# EAGLE design microMouse_schematic (EAGLE 9.5.2)
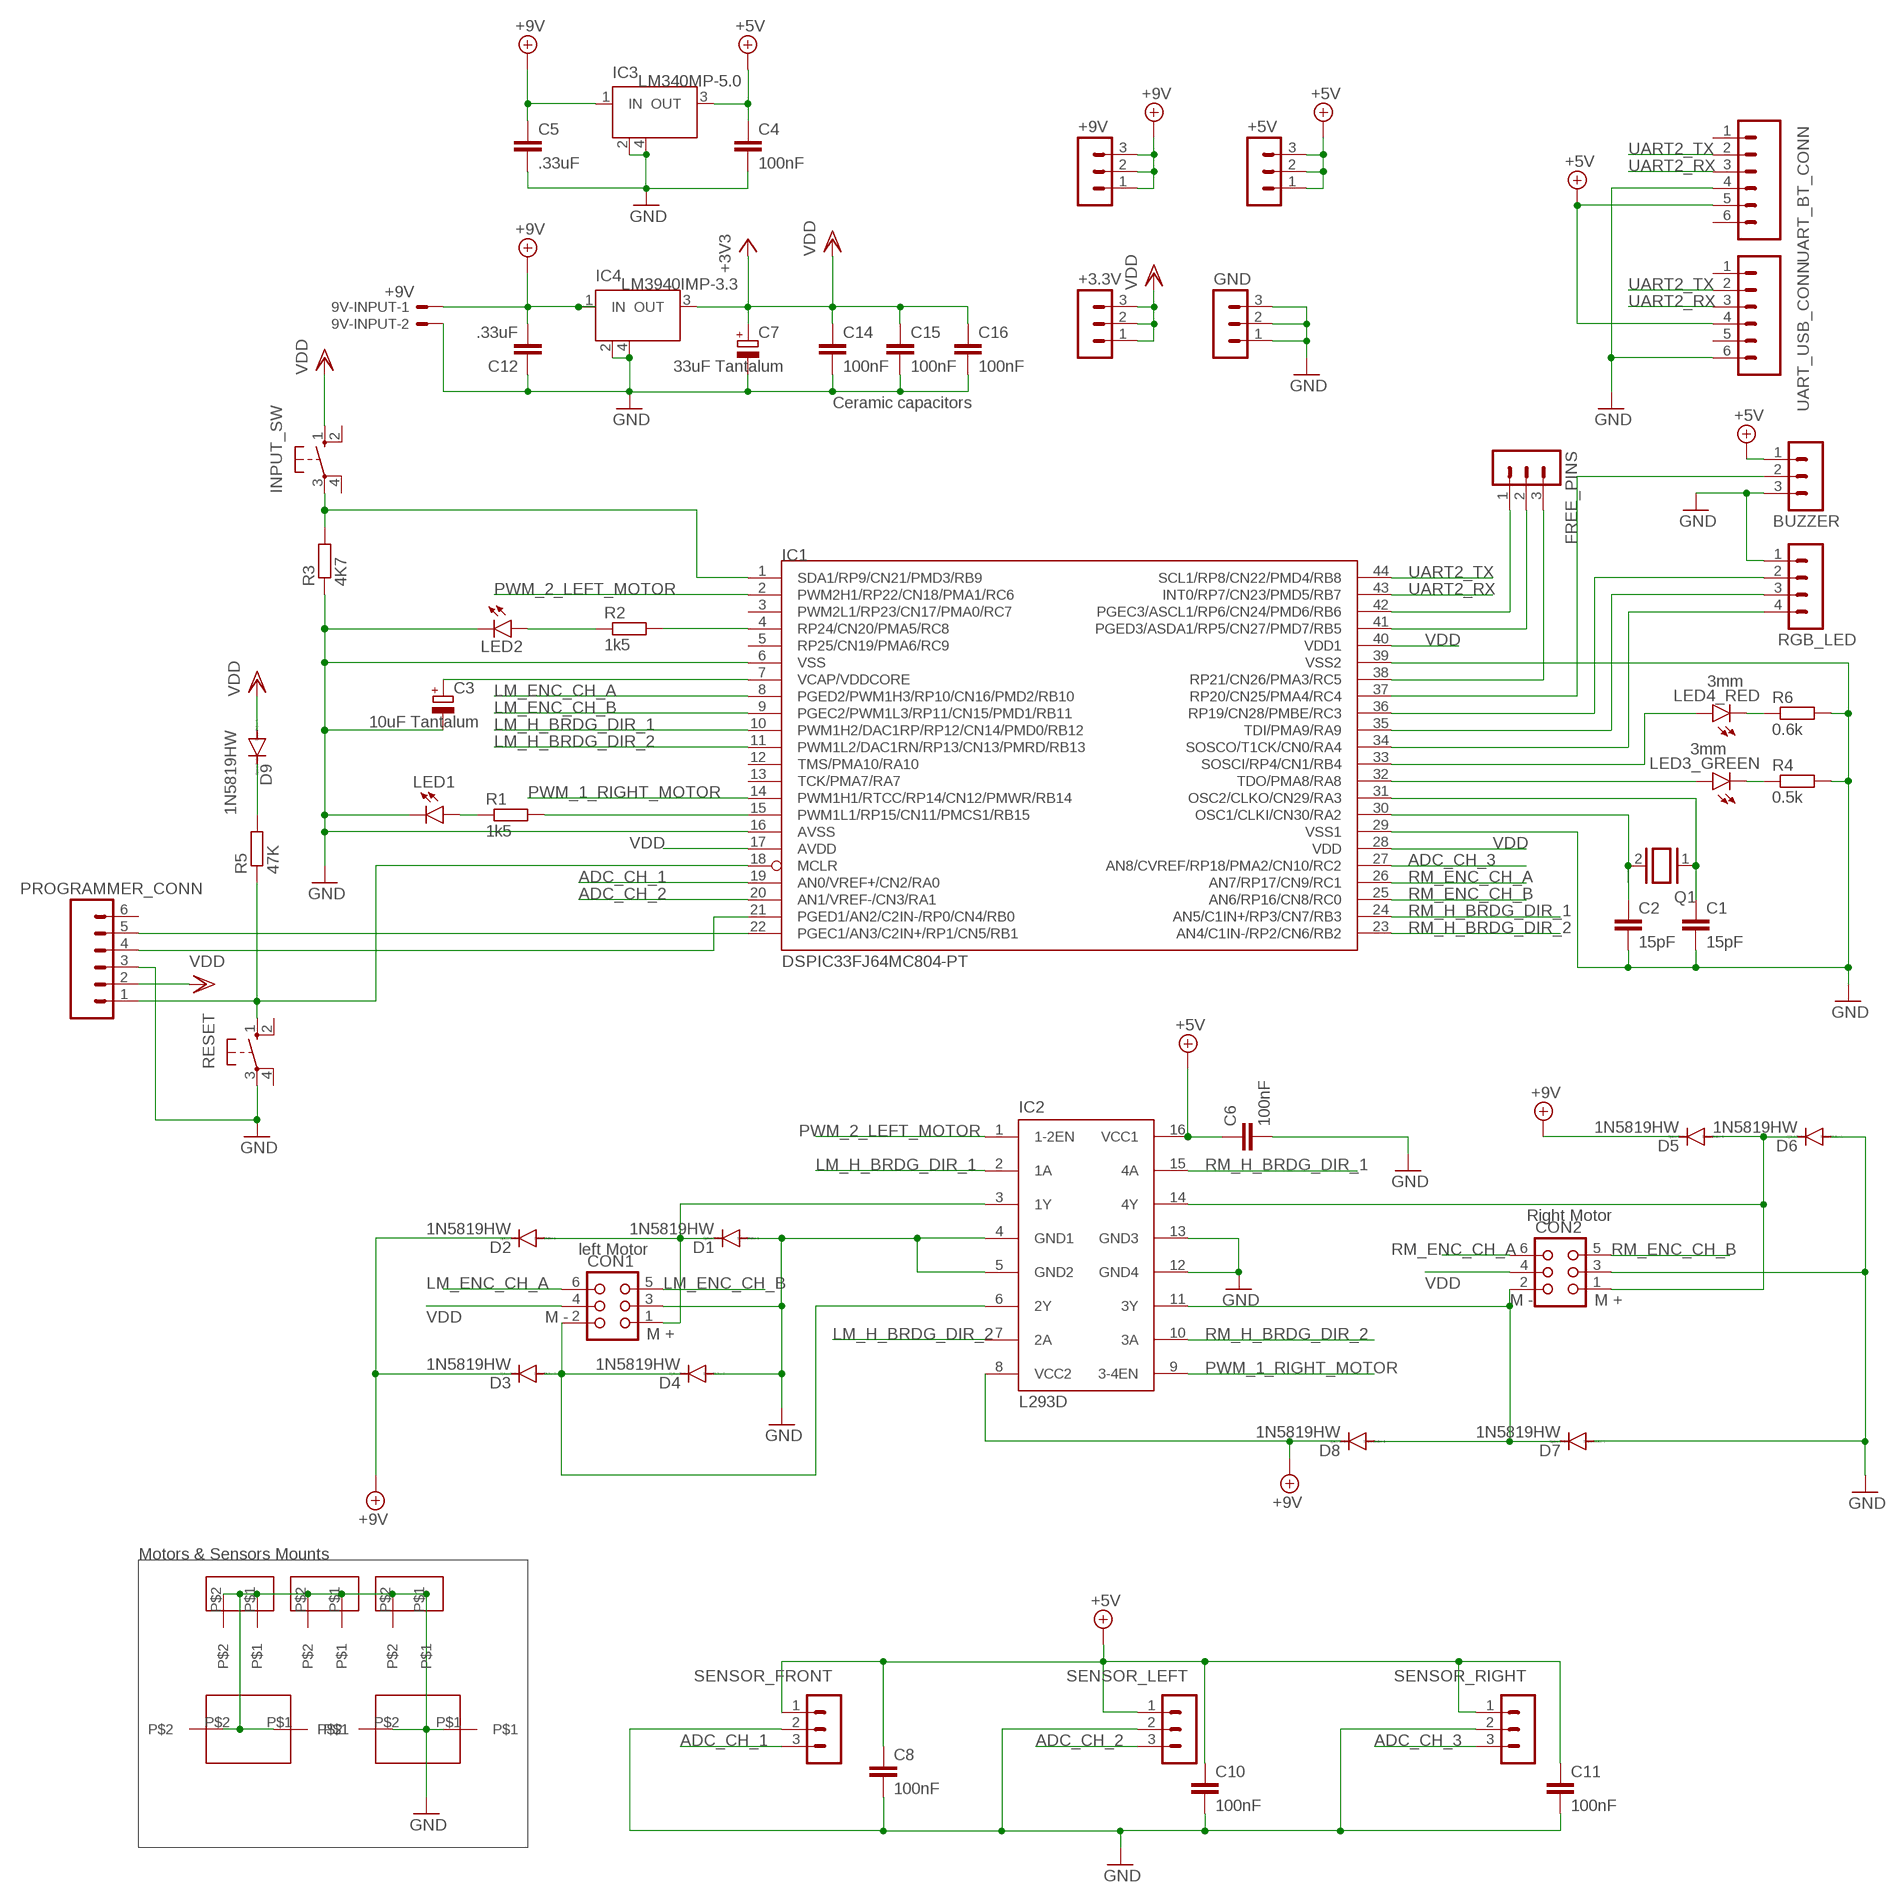
[diagram p0: schematic, sheet 1]

## Parts
9V-INPUT  +9V  22-23-2021  [22-23-2021]
+3.3V  MA03-1  [MA03-1]
+5V  MA03-1  [MA03-1]
+9V  MA03-1  [MA03-1]
BUZZER  MA03-1  [MA03-1]
C1  15pF  C-EUC0805  [C0805]
C2  15pF  C-EUC0805  [C0805]
C3  10uF Tantalum  CPOL-EUCT3216  [CT3216]
C4  100nF  C-EUC0805  [C0805]
C5  .33uF  C-EUC0805  [C0805]
C6  100nF  C-EUC0805  [C0805]
C7  33uF Tantalum  CPOL-EUCT7343  [CT7343]
C8  100nF  C-EUC0805  [C0805]
C10  100nF  C-EUC0805  [C0805]
C11  100nF  C-EUC0805  [C0805]
C12  .33uF  C-EUC0805  [C0805]
C14  100nF  C-EUC0805  [C0805]
C15  100nF  C-EUC0805  [C0805]
C16  100nF  C-EUC0805  [C0805]
CON1  CON06L  [CON06L]
CON2  CON06L  [CON06L]
D1  1N5819HW  CGRM4001-G  [SOD-123_MINI-SMA]
D2  1N5819HW  CGRM4001-G  [SOD-123_MINI-SMA]
D3  1N5819HW  CGRM4001-G  [SOD-123_MINI-SMA]
D4  1N5819HW  CGRM4001-G  [SOD-123_MINI-SMA]
D5  1N5819HW  CGRM4001-G  [SOD-123_MINI-SMA]
D6  1N5819HW  CGRM4001-G  [SOD-123_MINI-SMA]
D7  1N5819HW  CGRM4001-G  [SOD-123_MINI-SMA]
D8  1N5819HW  CGRM4001-G  [SOD-123_MINI-SMA]
D9  1N5819HW  CGRM4001-G  [SOD-123_MINI-SMA]
FREE_PINS  MA03-1  [MA03-1]
GND  MA03-1  [MA03-1]
IC1  DSPIC33FJ64MC804-PT  [TQFP44]
IC2  L293D  [DIL16]
IC3  LM340MP-5.0  LM340S  [SOT223]
IC4  LM3940IMP-3.3  LM340S  [SOT223]
INPUT_SW  10-XX  [B3F-10XX]
LED1  LED5MM  [LED5MM]
LED2  LED5MM  [LED5MM]
LED3_GREEN  3mm  LEDB155  [Q62902-B155]
LED4_RED  3mm  LEDB155  [Q62902-B155]
PROGRAMMER_CONN  M06  [06P]
Q1  XTAL/S  [QS]
R1  1k5  R-EU_R0805  [R0805]
R2  1k5  R-EU_R0805  [R0805]
R3  4K7  R-EU_R0805  [R0805]
R4  0.5k  R-EU_R0805  [R0805]
R5  47K  R-EU_R0805  [R0805]
R6  0.6k  R-EU_R0805  [R0805]
RESET  10-XX  [B3F-10XX]
RGB_LED  MA04-1  [MA04-1]
SENS_MNT_F  SENSOR_MOUNT_F  SENSOR_MOUNT  [SENSOR_MOUNT]
SENS_MNT_L  SENSOR_MOUNT_L  SENSOR_MOUNT  [SENSOR_MOUNT]
SENS_MNT_R  SENSOR_MOUNT_R  SENSOR_MOUNT  [SENSOR_MOUNT]
SENSOR_FRONT  MA03-1  [MA03-1]
SENSOR_LEFT  MA03-1  [MA03-1]
SENSOR_RIGHT  MA03-1  [MA03-1]
U$1  MOTOR_MOUNT  [MOTOR_MOUNT]
U$2  MOTOR_MOUNT  [MOTOR_MOUNT]
UART_BT_CONN  M06  [06P]
UART_USB_CONN  M06  [06P]

## Nets
+5V: +5V.1 +5V.2 +5V.3 BUZZER.1 C4.1 C6.1 C8.1 C10.1 C11.1 IC2.16(VCC1) IC3.3(OUT) SENSOR_FRONT.1 SENSOR_LEFT.1 SENSOR_RIGHT.1 UART_BT_CONN.5 UART_USB_CONN.4
+9V: 9V-INPUT.1 +9V.1 +9V.2 +9V.3 C5.1 C12.2 D2.C D3.C D5.C D8.C IC2.8(VCC2) IC3.1(IN) IC4.1(IN)
ADC_CH_1: IC1.19(AN0/VREF+/CN2/RA0) SENSOR_FRONT.3
ADC_CH_2: IC1.20(AN1/VREF-/CN3/RA1) SENSOR_LEFT.3
ADC_CH_3: IC1.27(AN8/CVREF/RP18/PMA2/CN10/RC2) SENSOR_RIGHT.3
GND: 9V-INPUT.2 BUZZER.3 C1.2 C2.2 C3.- C4.2 C5.2 C6.2 C7.- C8.2 C10.2 C11.2 C12.1 C14.2 C15.2 C16.2 CON1.3 CON2.3 D1.A D4.A D6.A D7.A GND.1 GND.2 GND.3 IC1.6(VSS) IC1.16(AVSS) IC1.29(VSS1) IC1.39(VSS2) IC2.4(GND1) IC2.5(GND2) IC2.12(GND4) IC2.13(GND3) IC3.2(GND) IC3.4(GND) IC4.2(GND) IC4.4(GND) LED1.K(C) LED2.K(C) PROGRAMMER_CONN.3 R3.1 R4.2 R6.2 RESET.3(P) RGB_LED.1 SENS_MNT_F.P$1 SENS_MNT_F.P$2 SENS_MNT_L.P$1 SENS_MNT_L.P$2 SENS_MNT_R.P$1 SENS_MNT_R.P$2 SENSOR_FRONT.2 SENSOR_LEFT.2 SENSOR_RIGHT.2 U$1.P$1 U$1.P$2 U$2.P$1 U$2.P$2 UART_BT_CONN.4 UART_USB_CONN.6
LM_ENC_CH_A: CON1.6 IC1.8(PGED2/PWM1H3/RP10/CN16/PMD2/RB10)
LM_ENC_CH_B: CON1.5 IC1.9(PGEC2/PWM1L3/RP11/CN15/PMD1/RB11)
LM_H_BRDG_DIR_1: IC1.10(PWM1H2/DAC1RP/RP12/CN14/PMD0/RB12) IC2.2(1A)
LM_H_BRDG_DIR_2: IC1.11(PWM1L2/DAC1RN/RP13/CN13/PMRD/RB13) IC2.7(2A)
N$1: IC1.4(RP24/CN20/PMA5/RC8) R2.2
N$2: CON2.1 D5.A D6.C IC2.14(4Y)
N$3: LED2.A R2.1
N$4: CON1.1 D1.C D2.A IC2.3(1Y)
N$5: IC1.22(PGEC1/AN3/C2IN+/RP1/CN5/RB1) PROGRAMMER_CONN.5
N$6: CON2.2 D7.C D8.A IC2.11(3Y)
N$7: CON1.2 D3.A D4.C IC2.6(2Y)
N$8: IC1.1(SDA1/RP9/CN21/PMD3/RB9) INPUT_SW.3(P) R3.2
N$9: IC1.32(TDO/PMA8/RA8) LED3_GREEN.A
N$10: C2.1 IC1.30(OSC1/CLKI/CN30/RA2) Q1.2
N$11: C1.1 IC1.31(OSC2/CLKO/CN29/RA3) Q1.1
N$12: IC1.21(PGED1/AN2/C2IN-/RP0/CN4/RB0) PROGRAMMER_CONN.4
N$13: LED3_GREEN.K(C) R4.1
N$14: IC1.15(PWM1L1/RP15/CN11/PMCS1/RB15) R1.2
N$15: IC1.33(SOSCI/RP4/CN1/RB4) LED4_RED.A
N$16: IC1.34(SOSCO/T1CK/CN0/RA4) RGB_LED.4
N$17: LED1.A R1.1
N$18: IC1.35(TDI/PMA9/RA9) RGB_LED.3
N$19: D9.C R5.2
N$20: IC1.36(RP19/CN28/PMBE/RC3) RGB_LED.2
N$21: BUZZER.2 IC1.37(RP20/CN25/PMA4/RC4)
N$22: FREE_PINS.1 IC1.42(PGEC3/ASCL1/RP6/CN24/PMD6/RB6)
N$23: FREE_PINS.2 IC1.41(PGED3/ASDA1/RP5/CN27/PMD7/RB5)
N$24: FREE_PINS.3 IC1.38(RP21/CN26/PMA3/RC5)
N$25: LED4_RED.K(C) R6.1
PWM_1_RIGHT_MOTOR: IC1.14(PWM1H1/RTCC/RP14/CN12/PMWR/RB14) IC2.9(3-4EN)
PWM_2_LEFT_MOTOR: IC1.2(PWM2H1/RP22/CN18/PMA1/RC6) IC2.1(1-2EN)
RESET: IC1.18(MCLR) PROGRAMMER_CONN.1 R5.1 RESET.1(S)
RM_ENC_CH_A: CON2.6 IC1.26(AN7/RP17/CN9/RC1)
RM_ENC_CH_B: CON2.5 IC1.25(AN6/RP16/CN8/RC0)
RM_H_BRDG_DIR_1: IC1.24(AN5/C1IN+/RP3/CN7/RB3) IC2.15(4A)
RM_H_BRDG_DIR_2: IC1.23(AN4/C1IN-/RP2/CN6/RB2) IC2.10(3A)
UART2_RX: IC1.43(INT0/RP7/CN23/PMD5/RB7) UART_BT_CONN.3 UART_USB_CONN.3
UART2_TX: IC1.44(SCL1/RP8/CN22/PMD4/RB8) UART_BT_CONN.2 UART_USB_CONN.2
VCAP/VDDCORE: C3.+ IC1.7(VCAP/VDDCORE)
VDD: +3.3V.1 +3.3V.2 +3.3V.3 C7.+ C14.1 C15.1 C16.1 CON1.4 CON2.4 D9.A IC1.17(AVDD) IC1.28(VDD) IC1.40(VDD1) IC4.3(OUT) INPUT_SW.1(S) PROGRAMMER_CONN.2 ; supply symbol labelled +3V3
Unconnected: IC1.3(PWM2L1/RP23/CN17/PMA0/RC7) IC1.5(RP25/CN19/PMA6/RC9) IC1.12(TMS/PMA10/RA10) IC1.13(TCK/PMA7/RA7) INPUT_SW.2(S1) INPUT_SW.4(P1) PROGRAMMER_CONN.6 RESET.2(S1) RESET.4(P1) UART_BT_CONN.1 UART_BT_CONN.6 UART_USB_CONN.1 UART_USB_CONN.5

## Notes on the sheet
- Ceramic capacitors
- Right Motor
- left Motor
- M - | M +
- M -
- M +
- Motors & Sensors Mounts

## Library data of the parts
9V-INPUT = con-molex:22-23-2021: .100" (2.54mm) Center Header - 2 Pin; MF: MOLEX; MPN: 22-23-2021; OC_FARNELL: 1462926; OC_NEWARK: 25C3832
+3.3V +5V +9V BUZZER FREE_PINS GND SENSOR_FRONT SENSOR_LEFT SENSOR_RIGHT = con-lstb:MA03-1: PIN HEADER; OC_FARNELL: unknown; OC_NEWARK: unknown
C1 C2 C4-C6 C8 C10-C12 C14-C16 = rcl:C-EU: CAPACITOR, European symbol; SPICEPREFIX: C
C3 C7 = rcl:CPOL-EU: POLARIZED CAPACITOR, European symbol; SPICEPREFIX: C
CON1 CON2 = con-harting:CON06L: CONNECTOR; OC_FARNELL: unknown; OC_NEWARK: unknown
D1-D9 = diode:CGRM400*-G: Molded plasitc,JEDEC SOD-123/Mini SMA Source: Comchip CGRM4001-G.pdf
IC1 = microchip-dspic33fjxxmc:DSPIC33FJ64MC804: dsPIC33FJ32MC302/304, dsPIC33FJ64MCX02/X04, AND dsPIC33FJ128MCX02/X04 High-Performance, 16-bit Digital Signal Controllers Package:44 Pin TQFP Operating Range: * Up to 40 MIPS operation (at 3.0V -3.6V): - Industrial temperature range (-40°C to +85°C) - Extended temperature range (-40°C to +125°C) High-Performance DSC CPU: * Modified Harvard architecture * C compiler optimized instruction set * 16-bit wide data path * 24-bit wide instructions * Linear program memory addressing up to 4M instruction words * Linear data memory addressing up to 64 Kbytes * 83 base instructions: mostly 1 word/1 cycle * Two 40-bit accumulators with rounding and saturation options * Flexible and powerful addressing modes: - Indirect - Modulo - Bit-Reversed * Software stack * 16 x 16 fractional/integer multiply operations * 32/16 and 16/16 divide operations * Single-cycle multiply and accumulate: - Accumulator write back for DSP operations - Dual data fetch * Up to ±16-bit shifts for up to 40-bit data Direct Memory Access (DMA): * 8-channel hardware DMA * Up to 2 Kbytes dual ported DMA buffer area (DMA RAM) to store data transferred via DMA: - Allows data transfer between RAM and a peripheral while CPU is executing code (no cycle stealing) * Most peripherals support DMA Timers/Capture/Compare/PWM: * Timer/Counters, up to five 16-bit timers: - Can pair up to make two 32-bit timers - One timer runs as a Real-Time Clock with an external 32.768 kHz oscillator - Programmable prescaler * Input Capture (up to four channels): - Capture on up, down or both edges - 16-bit capture input functions - 4-deep FIFO on each capture * Output Compare (up to four channels): - Single or Dual 16-bit Compare mode - 16-bit Glitchless PWM mode * Hardware Real-Time Clock/Calendar (RTCC): - Provides clock, calendar, and alarm functions Interrupt Controller: * 5-cycle latency * Up to 53 available interrupt sources * Up to three external interrupts * Seven programmable priority levels * Five processor exceptions Digital I/O: * Peripheral pin Select functionality * Up to 35 programmable digital I/O pins * Wake-up/Interrupt-on-Change for up to 31 pins * Output pins can drive from 3.0V to 3.6V * Up to 5V output with open drain configuration * All digital input pins are 5V tolerant * 4 mA sink on all I/O pins On-Chip Flash and SRAM: * Flash program memory (up to 128 Kbytes) * Data SRAM (up to 16 Kbytes) * Boot, Secure, and General Security for program Flash System Management: * Flexible clock options: - External, crystal, resonator, internal RC - Fully integrated Phase-Locked Loop (PLL) - Extremely low jitter PLL * Power-up Timer * Oscillator Start-up Timer/Stabilizer * Watchdog Timer with its own RC oscillator * Fail-Safe Clock Monitor * Reset by multiple sources Power Management: * On-chip 2.5V voltage regulator * Switch between clock sources in real time * Idle, Sleep, and Doze modes with fast wake-up Analog-to-Digital Converters (ADCs): * 10-bit, 1.1 Msps or 12-bit, 500 Ksps conversion: - Two and four simultaneous samples (10-bit ADC) - Up to nine input channels with auto-scanning - Conversion start can be manual or synchronized with one of four trigger sources - Conversion possible in Sleep mode - ±2 LSb max integral nonlinearity - ±1 LSb max differential nonlinearity Audio Digital-to-Analog Converter (DAC): - 16-bit Dual Channel DAC module - 100 Ksps maximum sampling rate - Second-Order Digital Delta-Sigma Modulator Comparator Module: * Two analog comparators with programmable input/output configuration CMOS Flash Technology: * Low-power, high-speed Flash technology * Fully static design * 3.3V (±10%) operating voltage * Industrial and Extended temperature * Low power consumption Motor Control Peripherals: * 6-channel 16-bit Motor Control PWM: - Three duty cycle generators - Independent or Complementary mode - Programmable dead-time and output polarity - Edge-aligned or center-aligned - Manual output override control - One Fault input - Trigger for ADC conversions - PWM frequency for 16-bit resolution (@ 40 MIPS) = 1220 Hz for Edge-Aligned mode, 610 Hz for Center-Aligned mode - PWM frequency for 11-bit resolution (@ 40 MIPS) = 39.1 kHz for Edge-Aligned mode, 19.55 kHz for Center-Aligned mode * 2-channel 16-bit Motor Control PWM: - One duty cycle generator - Independent or Complementary mode - Programmable dead time and output polarity - Edge-aligned or center-aligned - Manual output override control - One Fault input - Trigger for ADC conversions - PWM frequency for 16-bit resolution (@ 40 MIPS) = 1220 Hz for Edge-Aligned mode, 610 Hz for Center-Aligned mode - PWM frequency for 11-bit resolution (@ 40 MIPS) = 39.1 kHz for Edge-Aligned mode, 19.55 kHz for Center-Aligned mode * 2-Quadrature Encoder Interface module: - Phase A, Phase B, and index pulse input - 16-bit up/down position counter - Count direction status - Position Measurement (x2 and x4) mode - Programmable digital noise filters on inputs - Alternate 16-bit Timer/Counter mode - Interrupt on position counter rollover/underflow
IC2 = st-microelectronics:L293D: PUSH-PULL 4 CHANNEL DRIVER; MPN: L293D; OC_FARNELL: 9589619; OC_NEWARK: 56P8249
IC3 IC4 = linear:LM340S: 3-Terminal Positive Regulators Source: http://cache.national.com/ds/LM/LM340.pdf
INPUT_SW RESET = switch-omron:10-XX: OMRON SWITCH; MPN: B3F-1000; OC_FARNELL: 176432; OC_NEWARK: 36M3542
LED1 LED2 LED3_GREEN LED4_RED = led:LED: LED OSRAM: - CHIPLED LG R971, LG N971, LY N971, LG Q971, LY Q971, LO R971, LY R971 LH N974, LH R974 LS Q976, LO Q976, LY Q976 LO Q996 - Hyper CHIPLED LW Q18S LB Q993, LB Q99A, LB R99A - SideLED LS A670, LO A670, LY A670, LG A670, LP A670 LB A673, LV A673, LT A673, LW A673 LH A674 LY A675 LS A676, LA A676, LO A676, LY A676, LW A676 LS A679, LY A679, LG A679 - Hyper Micro SIDELED® LS Y876, LA Y876, LO Y876, LY Y876 LT Y87S - SmartLED LW L88C, LW L88S LB L89C, LB L89S, LG L890 LS L89K, LO L89K, LY L89K LS L896, LA L896, LO L896, LY L896 - TOPLED LS T670, LO T670, LY T670, LG T670, LP T670 LSG T670, LSP T670, LSY T670, LOP T670, LYG T670 LG T671, LOG T671, LSG T671 LB T673, LV T673, LT T673, LW T673 LH T674 LS T676, LA T676, LO T676, LY T676, LB T676, LH T676, LSB T676, LW T676 LB T67C, LV T67C, LT T67C, LS T67K, LO T67K, LY T67K, LW E67C LS E67B, LA E67B, LO E67B, LY E67B, LB E67C, LV E67C, LT E67C LW T67C LS T679, LY T679, LG T679 LS T770, LO T770, LY T770, LG T770, LP T770 LB T773, LV T773, LT T773, LW T773 LH T774 LS E675, LA E675, LY E675, LS T675 LS T776, LA T776, LO T776, LY T776, LB T776 LHGB T686 LT T68C, LB T68C - Hyper Mini TOPLED® LB M676 - Mini TOPLED Santana® LG M470 LS M47K, LO M47K, LY M47K Source: http://www.osram.convergy.de LUXEON: - LUMILED® LXK2-PW12-R00, LXK2-PW12-S00, LXK2-PW14-U00, LXK2-PW14-V00 LXK2-PM12-R00, LXK2-PM12-S00, LXK2-PM14-U00 LXK2-PE12-Q00, LXK2-PE12-R00, LXK2-PE12-S00, LXK2-PE14-T00, LXK2-PE14-U00 LXK2-PB12-K00, LXK2-PB12-L00, LXK2-PB12-M00, LXK2-PB14-N00, LXK2-PB14-P00, LXK2-PB14-Q00 LXK2-PR12-L00, LXK2-PR12-M00, LXK2-PR14-Q00, LXK2-PR14-R00 LXK2-PD12-Q00, LXK2-PD12-R00, LXK2-PD12-S00 LXK2-PH12-R00, LXK2-PH12-S00 LXK2-PL12-P00, LXK2-PL12-Q00, LXK2-PL12-R00 Source: www.luxeon.com KINGBRIGHT: KA-3528ASYC Source: www.kingbright.com
PROGRAMMER_CONN UART_BT_CONN UART_USB_CONN = con-amp-quick:M06: AMP QUICK CONNECTOR; OC_FARNELL: unknown; OC_NEWARK: unknown
Q1 = special:XTAL/S: CRYSTAL
R1-R6 = rcl:R-EU_: RESISTOR, European symbol; SPICEPREFIX: R
RGB_LED = con-lstb:MA04-1: PIN HEADER; OC_FARNELL: unknown; OC_NEWARK: unknown
SENS_MNT_F SENS_MNT_L SENS_MNT_R = linear:SENSOR_MOUNT
U$1 U$2 = linear:MOTOR_MOUNT

## Board
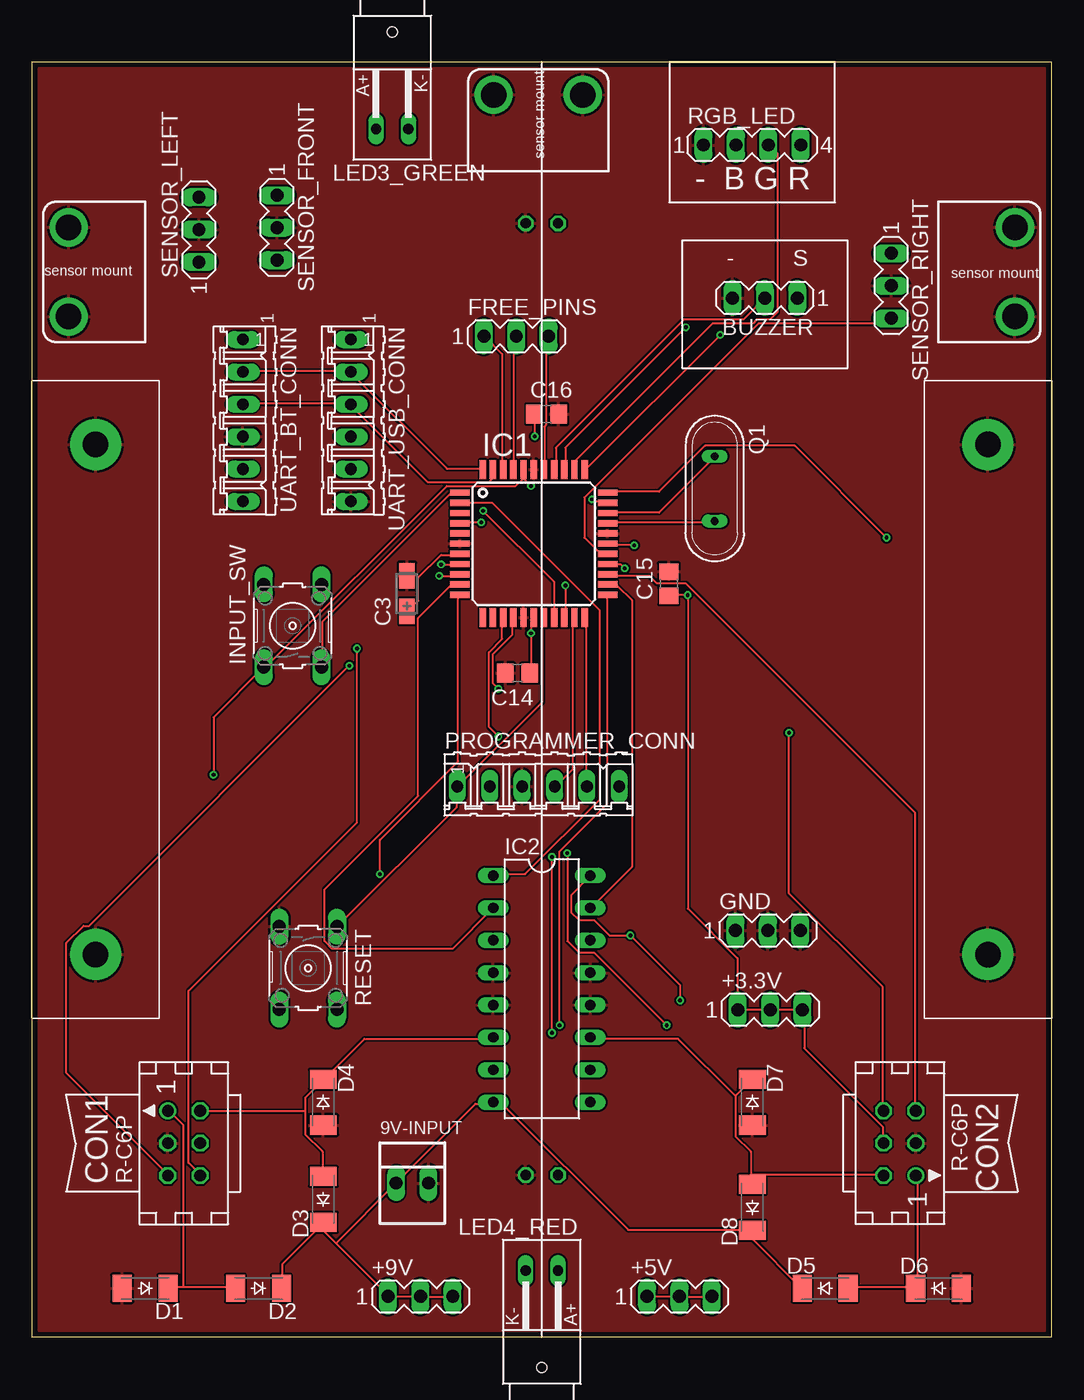
[diagram p1: board, top side]
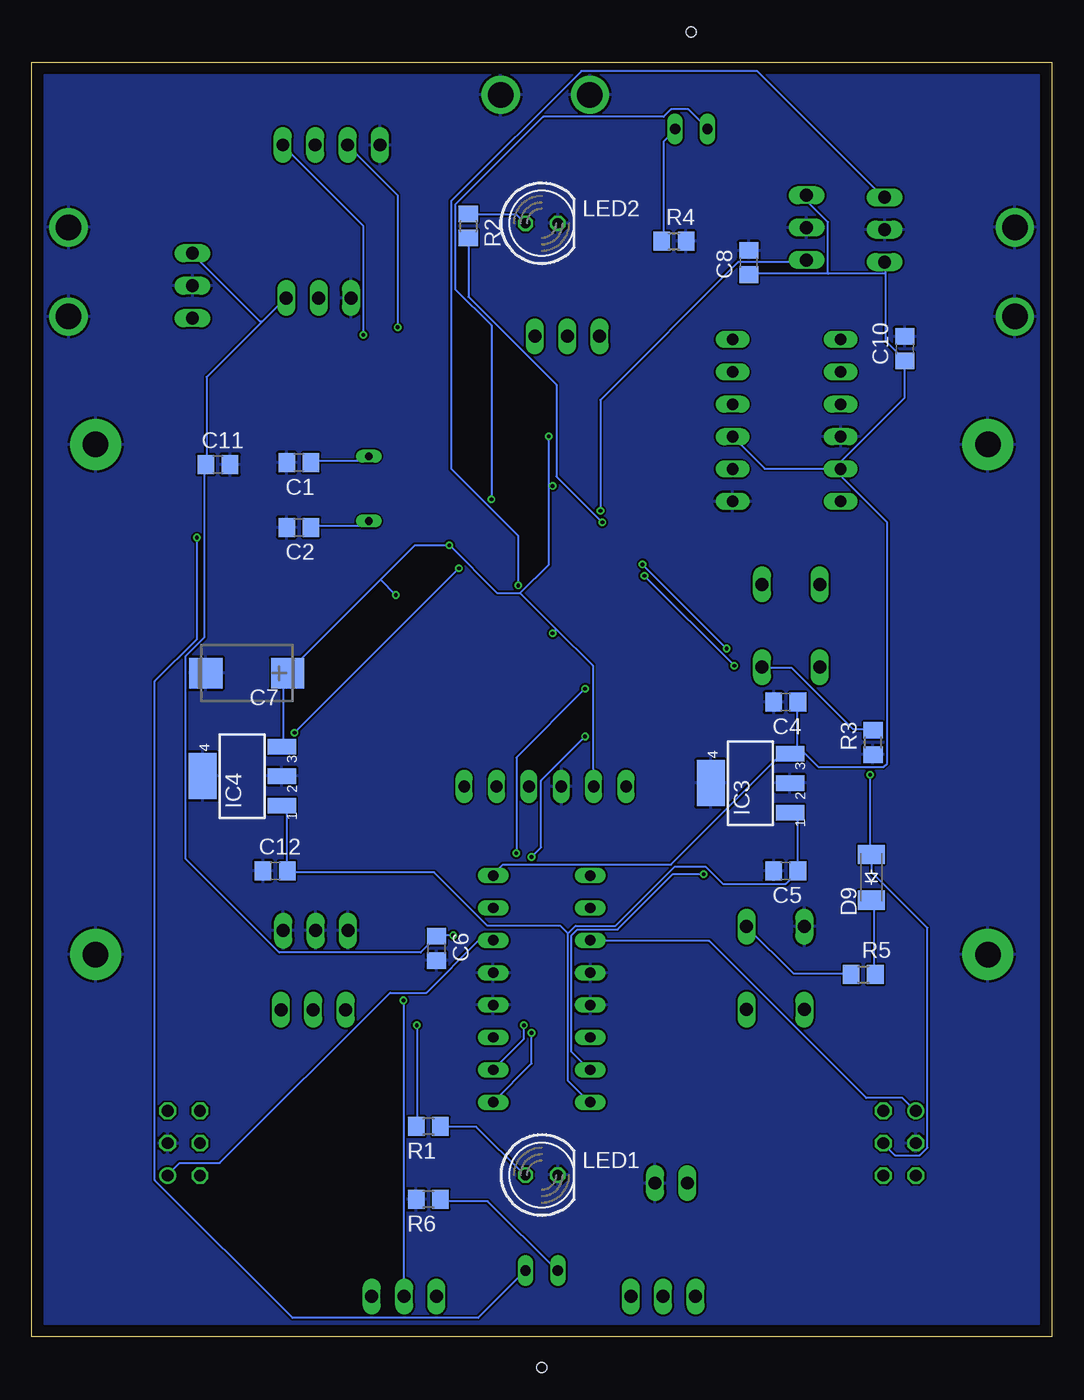
[diagram p2: board, bottom side, seen from below]

Size 80 x 100 mm. Coordinates in mm from the lower left corner, seen from the top.
Outline: 0,0 80,0 80,100 0,100 0,0
Copper layers (1*16): Top 0.035mm / dielectric 1.5mm / Bottom 0.035mm
Design rules "PCB-POOL Standard": minimum track width 0.15mm, minimum drill 0.3mm, track to track 0.15mm, track to pad 0.15mm, pad to pad 0.15mm, via to via 0.15mm, smd to smd 0.15mm, copper to edge 0.3mm, drill to drill 0.2mm, minimum pad ring 0.2mm, minimum via ring 0.15mm, stop-mask expansion 0.03mm, vias tented up to drill 0mil, thermal gap 0.2mm

### Footprints (pad centres in the part's own frame; a part is rotated, then mirrored left to right if it is on the bottom)
22-23-2021 = drill 1 long: 1 -1.27,0; 2 1.27,0
MA03-1 = drill 1.016 long: 1 -2.54,0; 2 0,0; 3 2.54,0
C0805 = smd 1.3 x 1.5: 1 -0.95,0; 2 0.95,0
CT3216 = smd 2 x 1.2: + -1.4,0; - 1.4,0
CT7343 = smd 2.6 x 2.4: + -3.2,0; - 3.2,0
CON06L = drill 0.914: 1 2.54,1.27 | drill 0.914 octagon: 2 2.54,-1.27; 3 0,1.27; 4 0,-1.27; 5 -2.54,1.27; 6 -2.54,-1.27
SOD-123_MINI-SMA = smd 1.5 x 2.1: A 1.8,0; C -1.8,0
TQFP44 = smd 1.5 x 0.5: 1 -5.8,4; 2 -5.8,3.2; 3 -5.8,2.4; 4 -5.8,1.6; 5 -5.8,0.8; 6 -5.8,0; 7 -5.8,-0.8; 8 -5.8,-1.6; 9 -5.8,-2.4; 10 -5.8,-3.2; 11 -5.8,-4; 23 5.8,-4; 24 5.8,-3.2; 25 5.8,-2.4; 26 5.8,-1.6; 27 5.8,-0.8; 28 5.8,0; 29 5.8,0.8; 30 5.8,1.6; 31 5.8,2.4; 32 5.8,3.2; 33 5.8,4 | smd 0.5 x 1.5: 12 -4,-5.8; 13 -3.2,-5.8; 14 -2.4,-5.8; 15 -1.6,-5.8; 16 -0.8,-5.8; 17 0,-5.8; 18 0.8,-5.8; 19 1.6,-5.8; 20 2.4,-5.8; 21 3.2,-5.8; 22 4,-5.8; 34 4,5.8; 35 3.2,5.8; 36 2.4,5.8; 37 1.6,5.8; 38 0.8,5.8; 39 0,5.8; 40 -0.8,5.8; 41 -1.6,5.8; 42 -2.4,5.8; 43 -3.2,5.8; 44 -4,5.8
DIL16 = drill 0.813 long: 1 -8.89,-3.81; 2 -6.35,-3.81; 3 -3.81,-3.81; 4 -1.27,-3.81; 5 1.27,-3.81; 6 3.81,-3.81; 7 6.35,-3.81; 8 8.89,-3.81; 9 8.89,3.81; 10 6.35,3.81; 11 3.81,3.81; 12 1.27,3.81; 13 -1.27,3.81; 14 -3.81,3.81; 15 -6.35,3.81; 16 -8.89,3.81
SOT223 = smd 1.219 x 2.235: 1 -2.311,-3.099; 2 0,-3.099; 3 2.311,-3.099 | smd 3.6 x 2.2: 4 0,3.099
B3F-10XX = drill 1.016 long: 1 -3.251,2.261; 2 3.251,2.261; 3 -3.251,-2.261; 4 3.251,-2.261
LED5MM = drill 0.813 octagon: A -1.27,0; K 1.27,0
Q62902-B155 = drill 0.813 long: A 7.62,-1.27; K 7.62,1.27 | hole 0.813: 0,0
06P = drill 0.914 long: 1 -6.35,0; 2 -3.81,0; 3 -1.27,0; 4 1.27,0; 5 3.81,0; 6 6.35,0
QS = drill 0.61 long: 1 -2.54,0; 2 2.54,0
R0805 = smd 1.3 x 1.5: 1 -0.95,0; 2 0.95,0
MA04-1 = drill 1.016 long: 1 -3.81,0; 2 -1.27,0; 3 1.27,0; 4 3.81,0
SENSOR_MOUNT = drill 2 pad 3: P$1 6,2; P$2 6,9
MOTOR_MOUNT = drill 2 pad 4: P$1 5,5; P$2 45,5

### Placement (x,y rotation side)
9V-INPUT  29.84,12.06 0 top
+3.3V  57.92,25.67 0 top
+5V  50.8,3.17 0 top
+9V  30.48,3.17 0 top
BUZZER  57.5,81.5 180 top
C1  59.05,68.58 180 bottom
C2  59.05,63.5 180 bottom
C3  29.43,58.31 90 top
C4  20.86,49.8 180 bottom
C5  20.86,36.56 180 bottom
C6  48.26,30.48 270 bottom
C7  63.15,52.07 180 bottom
C8  23.77,84.28 90 bottom
C10  11.53,77.53 90 bottom
C11  65.41,68.43 0 bottom
C12  60.92,36.56 0 bottom
C14  38.1,52.07 180 top
C15  49.97,59.08 90 top
C16  40.37,72.39 0 top
CON1  11.93,15.2 90 top
CON2  68.08,15.2 270 top
D1  8.89,3.81 180 top
D2  17.78,3.81 180 top
D3  22.86,10.79 90 top
D4  22.86,18.41 270 top
D5  62.23,3.81 0 top
D6  71.12,3.81 0 top
D7  56.52,18.41 270 top
D8  56.52,10.16 90 top
D9  14.14,36.06 90 bottom
FREE_PINS  38,78.5 0 top
GND  57.74,31.89 0 top
IC1  39.37,62.23 0 top
IC2  40.01,27.3 270 top
IC3  23.63,43.45 90 bottom
IC4  63.5,44 90 bottom
INPUT_SW  20.45,55.78 90 top
LED1  40.01,12.7 0 bottom
LED2  40.01,87.36 0 bottom
LED3_GREEN  28.27,102.37 270 top
LED4_RED  40.01,-2.4 90 top
PROGRAMMER_CONN  39.73,43.18 0 top
Q1  53.57,66.54 270 top
R1  48.9,16.51 180 bottom
R2  45.77,87.14 270 bottom
R3  14.01,46.62 90 bottom
R4  29.63,85.94 0 bottom
R5  14.78,28.44 0 bottom
R6  48.9,10.79 180 bottom
RESET  21.67,28.94 270 top
RGB_LED  56.5,93.5 0 top
SENS_MNT_F  71.12,78.04 0 top
SENS_MNT_L  45.22,91.44 90 top
SENS_MNT_R  8.89,89.04 180 top
SENSOR_FRONT  19.23,87.02 270 top
SENSOR_LEFT  13.11,86.86 90 top
SENSOR_RIGHT  67.41,82.45 270 top
U$1  10,25 90 top
U$2  80,25 90 top
UART_BT_CONN  16.55,71.89 270 top
UART_USB_CONN  25.04,71.89 270 top

### Tracks (layer width: path | path; a pad name or v marks a point on that pad's centre or on a via)
+5V  (via drill 0.3)
  Top 0.15: +5V.1 48.3,3.15 50.7,3.15 +5V.2 50.85,3.15 53.25,3.15 +5V.3 | IC2.16 43.8,36.15 42.3,34.65 42.3,33.3 42.9,32.7 44.1,32.7 45.3,31.5 v46.95,31.5 50.85,27.6 v50.85,26.4
  Bottom 0.15: UART_BT_CONN.5 16.65,68.1 22.5,68.1 24.9,70.5 UART_USB_CONN.4 | 13.05,83.4 13.05,84.3 SENSOR_LEFT.1 | 13.05,83.4 13.05,78.15 11.55,76.65 C10.1 11.55,76.5 11.55,73.65 16.5,68.7 16.5,68.1 UART_BT_CONN.5 | 13.05,83.4 17.55,83.4 | 17.55,83.4 23.7,83.4 C8.1 | 17.55,83.4 17.55,87.45 19.2,89.1 19.2,89.55 SENSOR_FRONT.1 | 61.95,79.65 60.15,81.45 BUZZER.1 | 61.95,79.65 66.3,75.3 66.3,68.55 C11.1 66.45,68.4 66.45,54.9 67.95,53.4 67.95,37.5 60.6,30.15 49.5,30.15 48.3,31.35 C6.1 48.15,31.5 v46.95,31.5 | 61.95,79.65 62.1,79.65 67.35,84.9 SENSOR_RIGHT.1 | 19.95,46.35 19.95,49.8 C4.1 | 19.95,46.35 20.4,45.9 IC3.3 | IC3.3 20.55,45.75 21.15,45.75 29.85,37.05 43.05,37.05 43.8,36.3 IC2.16 | v50.85,26.4 50.85,3.3 +5V.2 | 19.95,46.35 18.3,44.7 13.2,44.7 12.9,45 12.9,63.9 16.5,67.5 16.5,67.95 UART_BT_CONN.5 | 19.95,46.35 IC3.3
+9V
  Top 0.15: +9V.3 33,3.15 30.6,3.15 +9V.2 30.45,3.15 28.05,3.15 +9V.1 27.9,3.3 23.85,7.35 | 22.5,8.55 22.8,8.85 D3.C 22.5,8.55 | 22.5,8.55 19.65,5.7 19.65,3.9 D2.C | 23.85,7.35 22.65,8.55 22.5,8.55 | D5.C 60.3,3.9 56.55,7.65 56.55,8.25 D8.C 56.4,8.4 46.8,8.4 36.9,18.3 36.3,18.3 IC2.8 36.15,18.3 34.8,18.3 28.65,12.15 9V-INPUT.1 28.5,12 23.85,7.35
  Bottom 0.15: IC4.1 60.3,41.55 60,41.25 60,36.6 C12.2 59.85,36.45 48.45,36.45 44.25,32.25 38.55,32.25 37.95,31.65 | IC3.1 20.4,41.1 19.95,40.65 19.95,36.6 C5.1 19.95,36.45 20.85,35.55 25.8,35.55 27.15,36.9 29.55,36.9 34.2,32.25 37.35,32.25 37.95,31.65 | 37.95,31.65 37.95,20.1 36.3,18.45 IC2.8
ADC_CH_1  (via drill 0.3)
  Top 0.15: v35.4,64.8 40.95,59.25 40.95,56.55 IC1.19
  Bottom 0.15: v35.4,64.8 35.4,73.5 24.6,84.3 19.5,84.3 19.35,84.45 SENSOR_FRONT.3
ADC_CH_2  (via drill 0.3)
  Top 0.15: v41.85,58.95 41.85,56.55 IC1.20
  Bottom 0.15: v41.85,58.95 41.85,62.85 47.1,68.1 47.1,89.1 36.9,99.3 23.1,99.3 13.2,89.4 SENSOR_LEFT.3
ADC_CH_3
  Top 0.15: IC1.27 45.15,61.5 44.55,61.5 43.35,62.7 43.35,65.85 57,79.5 67.05,79.5 67.35,79.8 SENSOR_RIGHT.3
GND
  pour Bottom: 1,1 79,1 79,99 1,99
  pour Top: 0.5,0.5 79.5,0.5 79.5,99.5 0.5,99.5
LM_ENC_CH_A  (via drill 0.3)
  Top 0.15: v32.1,60.6 33.45,60.6 IC1.8 | v25.5,54 25.5,40.35 12.3,27.15 12.3,13.65 13.2,12.75 CON1.6
  Bottom 0.15: v25.5,54 v32.1,60.6
LM_ENC_CH_B  (via drill 0.3)
  Top 0.15: v31.95,59.7 33.45,59.7 IC1.9 | v24.9,52.65 4.5,32.25 4.05,32.25 2.7,30.9 2.7,20.7 10.65,12.75 CON1.5
  Bottom 0.15: v24.9,52.65 v31.95,59.7
LM_H_BRDG_DIR_1
  Top 0.15: IC1.10 33.45,58.95 32.85,58.95 30.3,56.4 30.3,42.45 22.95,35.1 22.95,31.05 23.55,30.45 33,30.45 36.15,33.6 IC2.2
LM_H_BRDG_DIR_2  (via drill 0.3)
  Top 0.15: v27.3,36.3 27.3,39 33.45,45.15 33.45,58.2 IC1.11
  Bottom 0.15: v27.3,36.3 29.7,36.3 34.05,31.95 37.2,31.95 37.65,31.5 37.65,22.35 36.3,21 IC2.7
N$1  (via drill 0.3)
  Top 0.15: v35.25,63.9 33.6,63.9 IC1.4
  Bottom 0.15: v35.25,63.9 38.85,67.5 38.85,74.7 45.75,81.6 45.75,86.1 R2.2
N$2
  Top 0.15: D5.A 64.05,3.9 69.3,3.9 D6.C 69.45,3.9 69.45,12.6 CON2.1
  Bottom 0.15: IC2.14 43.95,31.05 45,31.05 49.05,27 51.9,27 65.25,13.65 68.4,13.65 69.3,12.75 CON2.1
N$3
  Bottom 0.15: R2.1 45.75,88.05 42,88.05 41.4,87.45 LED2.A
N$4
  Top 0.15: 11.85,3.9 15.9,3.9 D2.A | 11.85,3.9 10.8,3.9 D1.C | 11.85,3.9 11.85,16.65 10.8,17.7 CON1.1
  Bottom 0.15: IC2.3 36.15,31.05 26.85,31.05 14.55,18.75 11.7,18.75 10.8,17.85 CON1.1
N$5
  Top 0.15: IC1.22 43.5,56.4 43.5,43.2 PROGRAMMER_CONN.5
N$6
  Top 0.15: 56.4,12.75 56.4,14.55 55.2,15.75 55.2,18.9 | 56.4,12.75 56.4,12 D8.A | D7.C 55.2,18.9 | 55.2,18.9 50.7,23.4 43.95,23.4 IC2.11 | 56.4,12.75 66.75,12.75 CON2.2
N$7
  Top 0.15: 21.45,17.7 21.45,18.75 22.8,20.1 D4.C 22.95,20.25 26.1,23.4 36.15,23.4 IC2.6 | 21.45,17.7 21.45,15.9 22.8,14.55 22.8,12.6 D3.A | 21.45,17.7 13.2,17.7 CON1.2
N$8
  Top 0.15: IC1.1 33.45,66.15 32.85,66.15 22.8,56.1 22.8,52.65 INPUT_SW.3
  Bottom 0.15: R3.2 14.1,47.7 15.6,47.7 20.4,52.5 22.65,52.5 INPUT_SW.3
N$9  (via drill 0.3)
  Top 0.15: v43.95,65.7 44.1,65.55 45.15,65.55 IC1.32
  Bottom 0.15: v43.95,65.7 43.95,79.35 46.8,82.2 46.8,88.8 39.9,95.7 30.45,95.7 29.85,96.3 28.5,96.3 27,94.8 LED3_GREEN.A
N$10
  Top 0.15: IC1.30 45.3,63.9 53.55,63.9 Q1.2
  Bottom 0.15: C2.1 58.05,63.6 54,63.6 53.7,63.9 Q1.2
N$11
  Top 0.15: IC1.31 45.3,64.65 49.2,64.65 53.55,69 Q1.1
  Bottom 0.15: C1.1 58.05,68.7 54,68.7 53.7,69 Q1.1
N$12
  Top 0.15: IC1.21 42.45,56.4 42.45,44.55 41.1,43.2 PROGRAMMER_CONN.4
N$13
  Bottom 0.15: R4.1 30.45,85.95 30.45,93.75 29.55,94.65 LED3_GREEN.K
N$14  (via drill 0.3)
  Top 0.15: v49.8,24.45 44.1,30.15 42.9,30.15 42,31.05 v42,37.95 | v36.6,50.85 36.15,51.3 36.15,53.55 37.65,55.05 37.65,56.4 IC1.15
  Bottom 0.15: v49.8,24.45 49.8,16.65 R1.2 | v42,37.95 42,45.45 v36.6,50.85
N$15  (via drill 0.3)
  Top 0.15: v67.05,62.7 59.85,69.9 52.8,69.9 49.2,66.3 45.3,66.3 IC1.33
  Bottom 0.15: v67.05,62.7 67.05,54.75 70.35,51.45 70.35,12.3 59.55,1.5 45,1.5 41.4,5.1 LED4_RED.A
N$16  (via drill 0.3)
  Top 0.15: v54,78.6 43.5,68.1 IC1.34
  Bottom 0.15: v54,78.6 54,87.15 60.3,93.45 RGB_LED.4
N$17
  Bottom 0.15: R1.1 47.85,16.5 45.15,16.5 41.4,12.75 LED1.A
N$18
  Top 0.15: IC1.35 42.6,68.1 42.6,68.7 53.4,79.5 56.55,79.5 56.85,79.8 57.9,79.8 58.5,80.4 58.5,92.85 57.9,93.45 RGB_LED.3
N$19
  Bottom 0.15: R5.2 13.95,28.5 13.95,34.05 14.1,34.2 D9.C
N$20  (via drill 0.3)
  Top 0.15: v51.3,79.2 41.85,69.75 41.85,68.1 IC1.36
  Bottom 0.15: v51.3,79.2 51.3,89.55 55.2,93.45 RGB_LED.2
N$21
  Top 0.15: BUZZER.2 55.8,79.8 51.15,79.8 41.1,69.75 41.1,68.1 IC1.37
N$22
  Top 0.15: IC1.42 36.9,68.1 36.9,77.1 35.55,78.45 FREE_PINS.1
N$23
  Top 0.15: FREE_PINS.2 37.8,78.3 37.8,68.1 IC1.41
N$24
  Top 0.15: IC1.38 40.2,68.1 40.2,71.4 40.35,71.55 40.35,78.3 40.5,78.45 FREE_PINS.3
N$25
  Bottom 0.15: R6.1 47.85,10.65 44.25,10.65 38.85,5.25 LED4_RED.K
PWM_1_RIGHT_MOTOR  (via drill 0.3)
  Top 0.15: v36.6,47.1 35.85,47.85 35.85,53.7 36.9,54.75 36.9,56.4 IC1.14 | v40.8,23.85 v40.8,37.65
  Bottom 0.15: v36.6,47.1 40.05,43.65 40.05,38.4 v40.8,37.65 | v40.8,23.85 40.8,21.45 43.8,18.45 IC2.9
PWM_2_LEFT_MOTOR
  Top 0.15: IC1.2 33.6,65.4 36.15,65.4 44.55,57 44.55,42.15 38.7,36.3 36.3,36.3 IC2.1
RESET
  Top 0.15: IC1.18 40.05,56.4 40.05,49.8 33.45,43.2 PROGRAMMER_CONN.1 33.3,43.05 33.3,41.55 24,32.25 RESET.1
  Bottom 0.15: R5.1 15.75,28.5 20.25,28.5 23.85,32.1 RESET.1
RM_ENC_CH_A  (via drill 0.3)
  Top 0.15: v46.5,60.3 46.2,60.6 45.3,60.6 IC1.26 | v59.4,47.4 59.4,34.8 66.75,27.45 66.75,17.85 CON2.6
  Bottom 0.15: v59.4,47.4 v46.5,60.3
RM_ENC_CH_B
  Top 0.15: IC1.25 45.3,59.7 48.45,59.7 49.05,59.1 51.3,59.1 69.3,41.1 69.3,17.85 CON2.5
RM_H_BRDG_DIR_1
  Top 0.15: IC1.24 45.3,58.95 45.9,58.95 47.1,57.75 47.1,36.9 43.95,33.75 IC2.15
RM_H_BRDG_DIR_2  (via drill 0.3)
  Top 0.15: v41.4,24.45 41.4,38.1 45.15,41.85 45.15,58.2 IC1.23
  Bottom 0.15: v41.4,24.45 41.4,23.4 43.8,21 IC2.10
UART2_RX
  Top 0.15: IC1.43 36.15,67.95 36.15,67.35 35.85,67.05 31.05,67.05 25.05,73.05 UART_USB_CONN.3 24.9,73.2 16.65,73.2 UART_BT_CONN.3
UART2_TX
  Top 0.15: IC1.44 35.25,68.1 32.55,68.1 25.05,75.6 UART_USB_CONN.2 24.9,75.75 16.65,75.75 UART_BT_CONN.2
VCAP/VDDCORE
  Top 0.15: IC1.7 33.45,61.35 32.1,61.35 30.3,59.55 30.3,57.75 29.55,57 C3.+
VDD  (via drill 0.3)
  Top 0.15: 38.55,67.35 38.55,67.95 IC1.40 38.55,67.35 | 38.55,67.35 37.95,66.75 32.55,66.75 18.3,52.5 INPUT_SW.1 18.15,52.5 14.25,48.6 v14.25,44.1 | CON2.4 66.75,15.3 66.75,16.5 60.6,22.65 60.6,25.65 +3.3V.3 60.45,25.65 58.05,25.65 +3.3V.2 57.9,25.65 55.5,25.65 +3.3V.1 55.35,25.8 55.35,29.7 51.45,33.6 v51.45,58.2 50.1,58.2 C15.1 | C14.1 39.15,52.2 v39.15,55.2 39.15,56.25 39.3,56.4 IC1.17 | v47.25,62.1 45.3,62.1 IC1.28 | v39.45,70.65 39.45,72.3 C16.1 | v39.15,66.75 38.55,67.35
  Bottom 0.15: CON1.4 13.2,15.15 12.3,14.25 10.35,14.25 9.75,14.85 9.75,32.1 14.1,36.45 14.1,37.8 D9.A 14.25,37.95 v14.25,44.1 | 52.65,59.4 59.85,52.2 C7.+ 60,52.05 60.3,51.75 60.3,46.35 IC4.3 | 52.65,59.4 49.95,62.1 v47.25,62.1 43.5,58.35 41.7,58.35 | 39.45,66.75 39.45,60.6 41.7,58.35 | 39.45,66.75 v39.45,70.65 | 52.65,59.4 v51.45,58.2 | 41.7,58.35 38.85,55.5 | 38.85,55.5 36,52.65 36,43.2 PROGRAMMER_CONN.2 | 38.85,55.5 v39.15,55.2 | 39.45,66.75 v39.15,66.75

### Text on the board
tPlace: - B G R | - S | 1 | 1